# Altium schematic sheet PSU.SchDoc
size A4; SheetNumber: 3; SheetTotal: 4
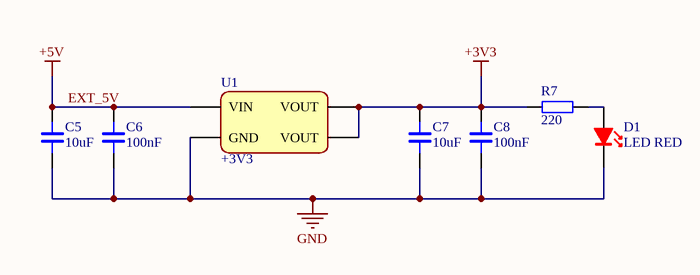
[diagram p0: PSU.SchDoc]

## Parts
C5  10uF  [CAP_0603]
C6  100nF  [CAP_0603]
C7  10uF  [CAP_0603]
C8  100nF  [CAP_0603]
D1  LED RED  [LED_RED_V0805]
R7  220  [RES_0603]
U1  +3V3  [PWR_LD1117_SOT223]

## Nets
+3V3: C7.2 C8.2 R7.1 U1.2(VOUT) U1.4(VOUT)
EXT_5V: C5.2 C6.2 U1.3(VIN)  [also labelled +5V]
GND: C5.1 C6.1 C7.1 C8.1 D1.C U1.1(GND)
NetD1_A: D1.A R7.2

## Library data of the parts
C5-C8 = CAP_0603: 0603 Multilayer Ceramic Capacitors MLCC - SMD/SMT ROHS; LCSC Part: ?; JLCPCB Part: ?; Mfr. Part: ?; Voltage: ?
  C5 C7: Value: 10uF
  C6 C8: Value: 100nF
D1 = LED_RED_V0805: 20mA 615nm~630nm RED; JLCPCB Part: ?; LCSC Part: ?; Mrf. Part: ?
R7 = RES_0603: 0603 Thick Film Resistor - Surface Mount ROHS; Mfr. Part: ?; LCSC Part: ?; JLCPCB Part: ?; Value: 220
U1 = PWR_LD1117: Linear Voltage Regulators (LDO); Mrf. Part: ?; LCSC Part: ?; JLCPCB Part: ?; Value: +3V3